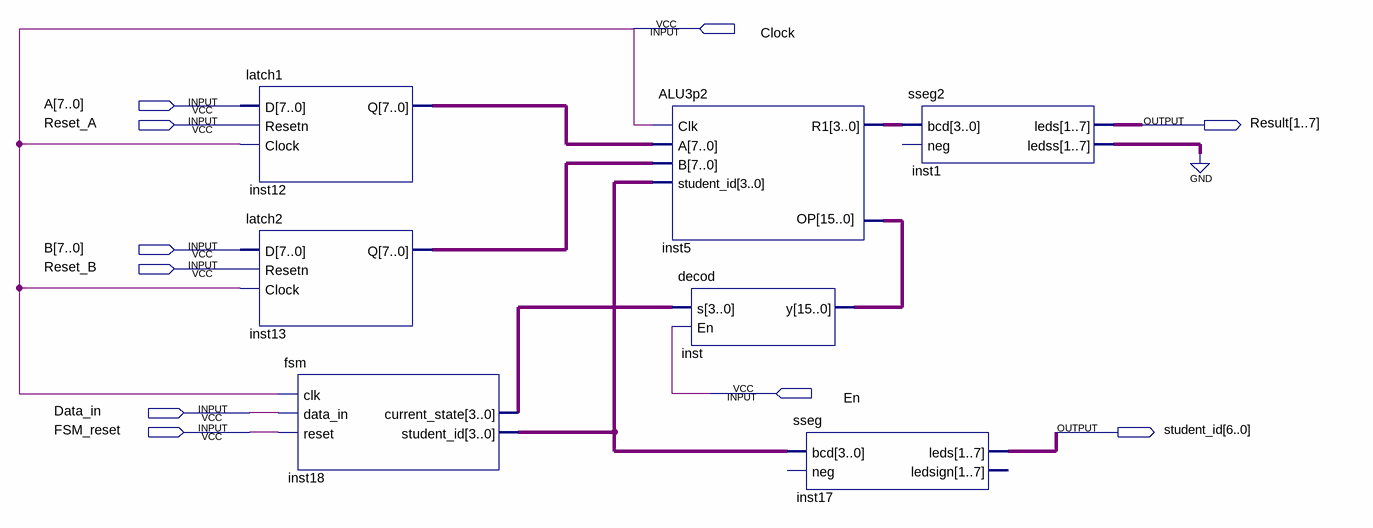
[diagram p0: schematic sheet]
// Quartus schematic GPUpart3funF.bdf as structural Verilog: 7 symbols, 10 pins
module GPUpart3funF (
  input  Clock,
  input  [7:0] A,
  input  Reset_A,
  input  [7:0] B,
  input  Reset_B,
  input  En,
  input  Data_in,
  input  FSM_reset,
  output [1:7] Result,
  output [6:0] student_id
);

  wire [3:0] inst5_r1, inst18_current_state, inst18_student_id;
  wire [6:0] inst1_ledss;
  wire [7:0] inst12_q, inst13_q;
  wire [15:0] inst_y;

  latch1 inst12 (.D(A), .Resetn(Reset_A), .Clock(Clock), .Q(inst12_q));
  latch2 inst13 (.D(B), .Resetn(Reset_B), .Clock(Clock), .Q(inst13_q));
  fsm inst18 (
    .clk(Clock), .data_in(Data_in), .reset(FSM_reset), .student_id(inst18_student_id),
    .current_state(inst18_current_state));
  ALU3p2 inst5 (.Clk(Clock), .A(inst12_q), .B(inst13_q), .student_id(inst18_student_id), .OP(inst_y), .R1(inst5_r1));
  decod inst (.s(inst18_current_state), .En(En), .y(inst_y));
  sseg inst17 (.bcd(inst18_student_id), .leds(student_id));  // open: neg, ledsign
  sseg2 inst1 (.bcd(inst5_r1), .leds(Result), .ledss(inst1_ledss));  // open: neg
  // also tied to GND on the sheet: {inst1_ledss[0], inst1_ledss[1], inst1_ledss[2], inst1_ledss[3], inst1_ledss[4], inst1_ledss[5], inst1_ledss[6]}
endmodule
